# Altium schematic sheet Battery Manager.SchDoc: Battery Manager
size A4; CompanyName: St. Cloud State University; Organization: Senior Design Project; Address1: Prosthetic Hand; Address2: Matthew Varas; Address3: Rachel Mertz; Address4: Donnell Jones; DocumentNumber: 3; Revision: 1.1; SheetNumber: 3; SheetTotal: 5
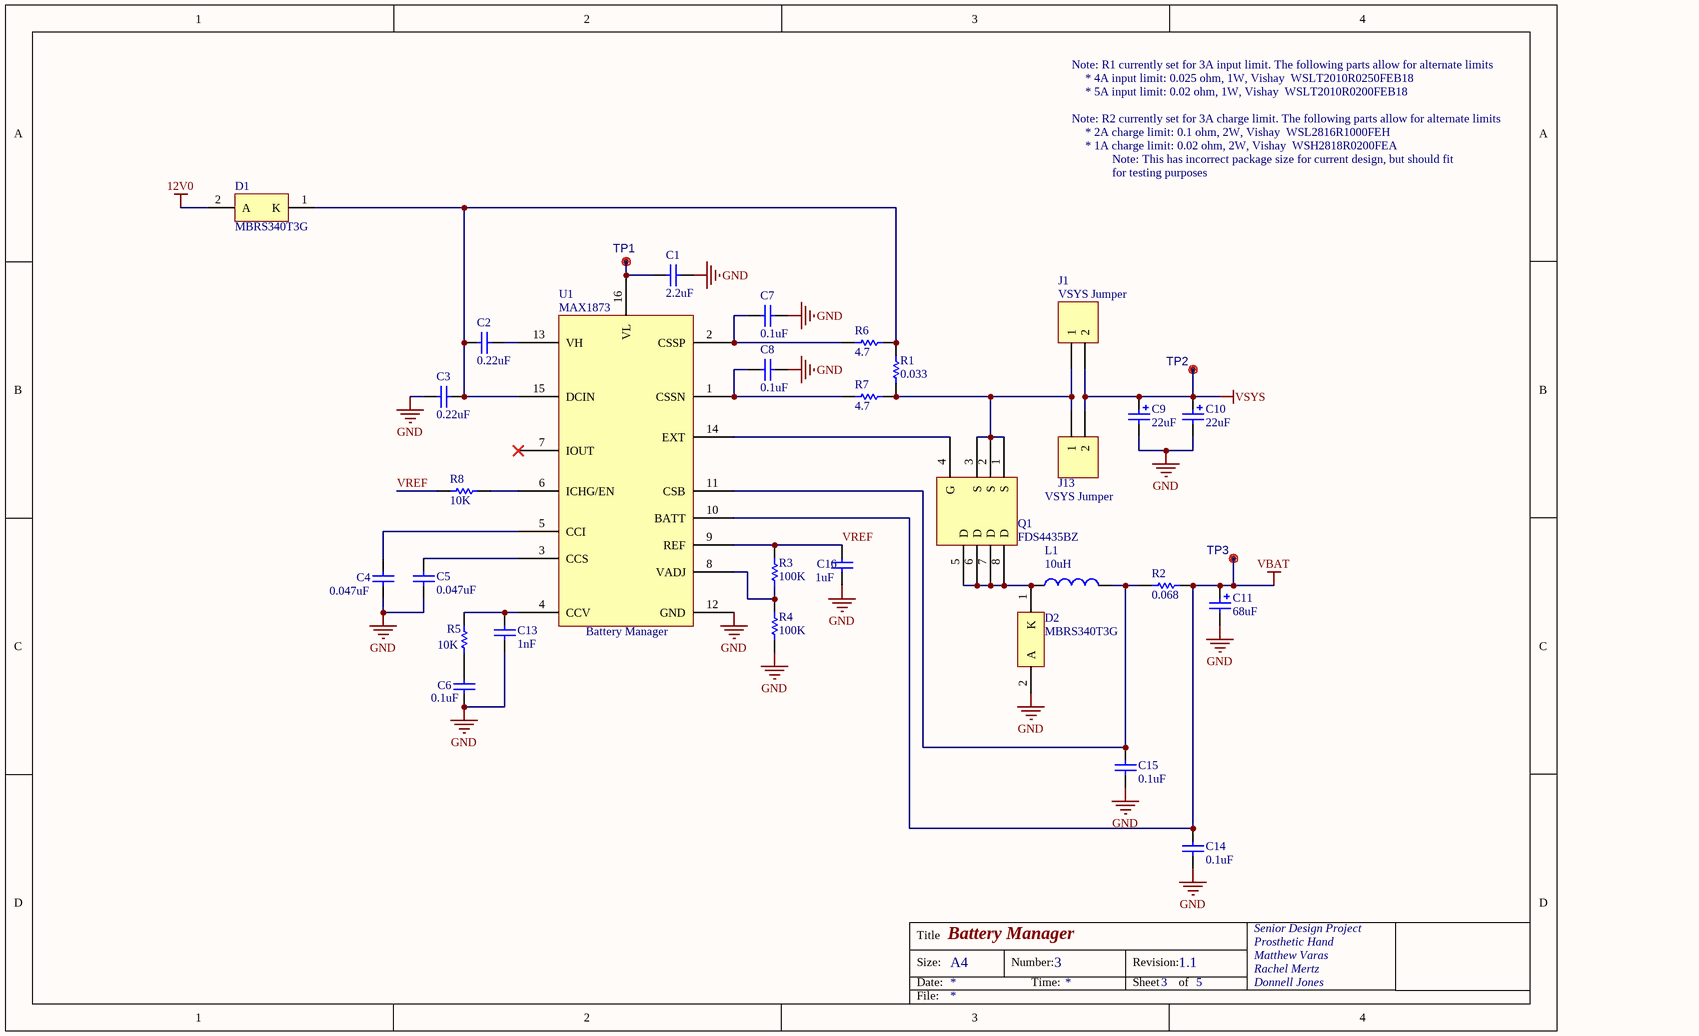
[diagram p0: Battery Manager.SchDoc]

## Parts
C1  2.2uF  [CAPC0805(2012)145_N]
C2  0.22uF  [CAPC0805(2012)145_N]
C3  0.22uF  [CAPC0805(2012)145_N]
C4  0.047uF  [CAPC0805(2012)75_N]
C5  0.047uF  [CAPC0805(2012)75_N]
C6  0.1uF  [CAPC0805(2012)145_N]
C7  0.1uF  [CAPC0805(2012)145_N]
C8  0.1uF  [CAPC0805(2012)145_N]
C9  22uF  [Cap Tant D]
C10  22uF  [Cap Tant D]
C11  68uF  [Cap Tant E]
C13  1nF  [CAPC0603(1608)100_N]
C14  0.1uF  [CAPC0805(2012)145_N]
C15  0.1uF  [CAPC0805(2012)145_N]
C16  1uF  [CAPC0805(2012)100_N]
D1  MBRS340T3G  [ONSC-SMC-2-403-03_V]
D2  MBRS340T3G  [ONSC-SMC-2-403-03_V]
J1  VSYS Jumper  [HDR1X2]
J13  VSYS Jumper  [HDR1X2]
L1  10uH  [SRR1260 Ind]
Q1  FDS4435BZ  [SOIC-8]
R1  0.033  [RESC2010(5025)_N]
R2  0.068  [WSL2816]
R3  100K  [RESC0805(2012)_N]
R4  100K  [RESC0805(2012)_N]
R5  10K  [RESC0805(2012)_N]
R6  4.7  [RESC0603(1608)_N]
R7  4.7  [RESC0603(1608)_N]
R8  10K  [RESC0805(2012)_N]
TP1  Test Point  [Testpoint_70]  (value not drawn)
TP2  Test Point  [Testpoint_70]  (value not drawn)
TP3  Test Point  [Testpoint_70]  (value not drawn)
U1  MAX1873  Desc: Battery Manager  [QSOP-16]

## Nets
12V0: D1.2(A)
GND: C1.2 C3.2 C4.2 C5.2 C6.1 C7.1 C8.1 C9.2 C10.2 C11.2 C13.1 C14.2 C15.1 C16.1 D2.2(A) R4.1 U1.12(GND)
VBAT: C11.1 C14.1 R2.1 TP3.1(M80) U1.10(BATT)
VSYS: C9.1 C10.1 J1.2 J13.2 TP2.1(M80)
VREF: C16.2 R3.2 R8.2 U1.9(REF)
NetC1_1: C1.1 TP1.1(M80) U1.16(VL)
NetC2_1: C2.1 C3.1 D1.1(K) R1.2 R6.1 U1.15(DCIN)
NetC2_2: C2.2 U1.13(VH)
NetC4_1: C4.1 U1.5(CCI)
NetC5_1: C5.1 U1.3(CCS)
NetC6_2: C6.2 R5.2
NetC7_2: C7.2 R6.2 U1.2(CSSP)
NetC8_2: C8.2 R7.2 U1.1(CSSN)
NetC13_2: C13.2 R5.1 U1.4(CCV)
NetC15_2: C15.2 L1.2 R2.2 U1.11(CSB)
NetD2_1: D2.1(K) L1.1 Q1.5(D) Q1.6(D) Q1.7(D) Q1.8(D)
NetJ1_1: J1.1 J13.1 Q1.1(S) Q1.2(S) Q1.3(S) R1.1 R7.1
NetQ1_4: Q1.4(G) U1.14(EXT)
NetR3_1: R3.1 R4.2 U1.8(VADJ)
NetR8_1: R8.1 U1.6(ICHG/EN)

Not connected (* = marked no-connect by the designer): U1 7(IOUT)*

## Notes on the sheet
- Note: R1 currently set for 3A input limit. The following parts allow for alternate limits
- * 4A input limit: 0.025 ohm, 1W, Vishay  WSLT2010R0250FEB18
- * 5A input limit: 0.02 ohm, 1W, Vishay  WSLT2010R0200FEB18
- Note: R2 currently set for 3A charge limit. The following parts allow for alternate limits
- * 2A charge limit: 0.1 ohm, 2W, Vishay  WSL2816R1000FEH
- * 1A charge limit: 0.02 ohm, 2W, Vishay  WSH2818R0200FEA
- Note: This has incorrect package size for current design, but should fit
- for testing purposes
- Title
- Size:
- Date:
- A4
- Number:
- Time:
- Revision:
- Sheet
- of
- File:

## Library data of the parts
C1 = CMP-1036-04844-1: CAP CER 2.2UF 50V X5R 0805; Tolerance: Â±10%; Case-EIA: 0805; Case-Metric: 2012; MFG_PN01: C2012X5R1H225K085AB; MFG_NAME01: TDK; DIGI_PN01: 445-14407-1-ND; Rated Voltage: 50 V; Max Thickness: 1.45 mm; Value: 2.2uF; Technology: SMT
C2 C3 = CMP-1036-04552-1: CAP CER 0.22UF 35V X5R 0805; Value: 220nF; Tolerance: Â±10%; Case-Metric: 2012; Case-EIA: 0805; Rated Voltage: 50 V; MFG_PN01: GMK212BJ224KG; MFG_NAME01: Taiyo Yuden; DIGI_PN01: 587-3366-1-ND; Max Thickness: 1.45 mm; Technology: SMT
C4 C5 = CMP-1036-04259-1: CAP CER 0.047UF 50V X7R 0805; Value: 47nF; Case-EIA: 0805; Case-Metric: 2012; Tolerance: Â±10%; MFG_PN01: GCM21BR71H473KA37L; MFG_NAME01: Murata; DIGI_PN01: 490-8050-1-ND; Max Thickness: 0.75 mm; Technology: SMT; Rated Voltage: 50 V
C6-C8 C14 C15 = CMP-1036-04419-1: CAP CER 0.1UF 50V X7R 0805; Tolerance: Â±10%; Case-EIA: 0805; Case-Metric: 2012; Value: 100nF; MFG_PN01: C2012X7R1H104K125AM; MFG_NAME01: TDK; DIGI_PN01: 445-6045-1-ND; Rated Voltage: 50 V; Technology: SMT; Max Thickness: 1.45 mm
C9 C10 = Cap Pol2: CAP TANT 22UF 35V 10% 2917; DIGI_PN01: 478-3356-1-ND; MFG_NAME01: AVX; MFG_PN01: TPSD226K035R0200; Case-EIA: 2917; Value: 22uF
C11 = Cap Pol2: CAP TANT 68UF 25V 20% 2917; DIGI_PN01: 478-4152-1-ND; MFG_NAME01: AVX; MFG_PN01: TPSE686M025R0125; Case-EIA: 2917; Value: 68uF
C13 = CMP-1035-01889-1: CAP CER 1000PF 50V X7R 0603; Tolerance: Â±10%; Case-EIA: 0603; Case-Metric: 1608; MFG_PN01: GRM188R71H102KA01D; MFG_NAME01: Murata; DIGI_PN01: 490-1494-1-ND; Value: 1nF; Technology: SMT; Rated Voltage: 50 V; Max Thickness: 1 mm
C16 = CMP-1036-04737-1: CAP CER 1UF 25V X7R 0805; Case-EIA: 0805; Rated Voltage: 10 V; Case-Metric: 2012; Tolerance: Â±10%; MFG_PN01: C2012X7R1E105K125AB; MFG_NAME01: TDK; DIGI_PN01: 445-1354-1-ND; Technology: SMT; Max Thickness: 1 mm; Value: 1uF
D1 D2 = CMP-1055-00380-1: DIODE SCHOTTKY 40V 4A SMC; Manufacturer: On Semiconductor; Configuration: Single; IFSM Max (A): 80; Packing: Tape and Reel; DIGI_PN01: MBRS340T3GOSCT-ND; Case-EIA: DO-214AB SMC; ComponentLink3Description: Package Specification; ComponentLink1Description: Manufacturer URL; DatasheetVersion: Rev. 11; PackageDescription: 2-Pin Small Molded Package, J-Bend Lead, Body 5.845 x 6.855 mm; PackageVersion: Rev. E, 08/2005; RoHS: TRUE; PackageReference: SMC-2-403-03; ComponentLink3URL: http://www.onsemi.com/pub_link/Collateral/403-03.PDF; ComponentLink2URL: http://www.onsemi.cn/pub_link/Collateral/MBRS340T3-D.PDF; PartNumber: MBRS340T3G; Mounting Technology: Surface Mount; ComponentLink1URL: http://www.onsemi.com/; ComponentLink2Description: Datasheet; MFG_PN01: MBRS340T3G; MFG_NAME01: ON Semiconductor
J1 J13 = Header 2: CONN HEADER .100 SINGL STR 2POS; MFG_PN01: PEC02SAAN; MFG_NAME01: Sullins Connector Solutions; DIGI_PN01: S1012E-02-ND; LatestRevisionDate: 17-Jul-2002; LatestRevisionNote: Re-released for DXP Platform.; Publisher: Altium Limited
L1 = SRR1260A-100MCT-ND: FIXED IND 10UH 5.5A 20 MOHM SMD; MFG_NAME01: Bourns; Current Rating: 5.5A; MFG_PN01: SRR1260A-100M; DIGI_PN01: SRR1260A-100MCT-ND; Value: 10uH
Q1 = FDS4435BZ: MOSFET P-CH 30V 8.8A 8-SOIC; MFG_NAME01: Fairchild Semiconductor; DIGI_PN01: FDS4435BZCT-ND; MFG_PN01: FDS4435BZ; Case-EIA: 8-SOIC
R1 = CMP-1017-00002-1: RES SMD 0.033 OHM 1% 1W 2010; Case-Metric: 5025; Case-EIA: 2010; MFG_PN01: WSL2010R0330FEA18; DIGI_PN01: WSLF-.033CT-ND; MFG_NAME01: Murata; Tolerance: 1%; Technology: SMT; Power: 1W; Value: 0.033
R2 = CMP-1017-00002-1: RES SMD 0.068 OHM 1% 2W 2816; Case-Metric: 5025; Case-EIA: 2816; MFG_PN01: WSL2816R0680FEH; DIGI_PN01: WSLK-.068CT-ND; MFG_NAME01: Vishay Dale; Tolerance: 1%; Technology: SMT; Power: 2W; Value: 0.068
R3 R4 = CMP-1013-00736-1: RES SMD 100K OHM 1% 1/8W 0805; Case-Metric: 2012; Power: 0.125 W; Case-EIA: 0805; MFG_PN01: RC0805FR-07100KL; DIGI_PN01: 311-100KCRCT-ND; MFG_NAME01: Yageo; Value: 100K; Tolerance: 1 %; Technology: SMT
R5 R8 = CMP-1013-00623-1: RES SMD 10K OHM 1% 1/8W 0805; Case-Metric: 2012; Case-EIA: 0805; Power: 0.125 W; MFG_PN01: RC0805FR-0710KL; MFG_NAME01: Yageo; DIGI_PN01: 311-10.0KCRCT-ND; Value: 10K; Tolerance: 1 %; Technology: SMT
R6 R7 = CMP-1012-00247-1: RES SMD 4.7 OHM 1% 1/10W 0603; Case-EIA: 0603; Power: 0.1 W; Case-Metric: 1608; Value: 4.70 Ohm; MFG_PN01: RC1608F4R7CS; MFG_NAME01: Samsung; DIGI_PN01: 1276-4486-1-ND; Technology: SMT; Tolerance: 1 %
TP1-TP3 = Test Point: Test Pad; MFG_PN01: DNP; MFG_NAME01: DNP; DNP: DNP
U1 = MAX1873: IC CNTRLR CHARGE LI+ 16-QSOP; MFG_PN01: MAX1873REEE+T; MFG_NAME01: Maxim Integrated; DIGI_PN01: MAX1873REEE+TCT-ND; Case-EIA: 16-SSOP